# Altium project MFC.PrjPcb
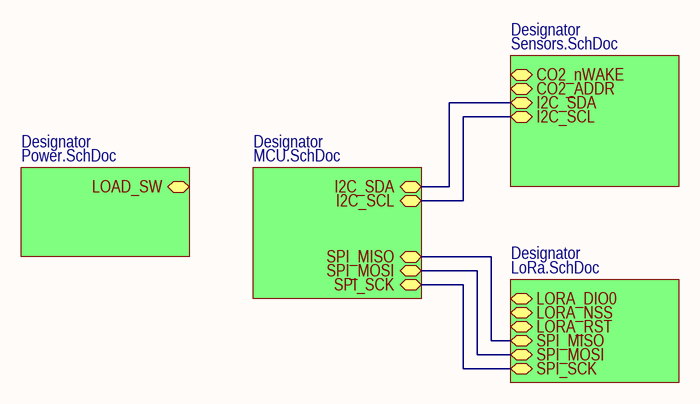
[diagram p0: Main.SchDoc]
6 sheets, 28 parts. Net scope: hierarchical (ports join the sheet entries above them; power ports are global).
Board file: MFC.PcbDoc
Sheets:
  Main.SchDoc
    Designator = Power.SchDoc
    Designator = MCU.SchDoc
    Designator = LoRa.SchDoc
    Designator = Sensors.SchDoc
  Sheet6.SchDoc

## Sheet Main.SchDoc: Наименование
size 209 x 297 mm; ApprovedBy: Утвердил; CheckedBy: Проверил; Author: Разработал; CompanyName: Организация; DrawnBy: Н.Контр; Engineer: Т.Контр; SheetNumber: 1; SheetTotal: 6; PageSetup: Record=PageOptions|CenterHorizontal=True|CenterVertical=True|PrintScale=0.94|XCorrection=1.00|YCorrection=1.00|PrintKind=1|BorderSize=5000000|LeftOffset=0|BottomOffset=0|Orientation=1|PaperLength=1000|PaperWidth=1000|Scale=100|PaperSource=7|PrintQuality=-4|MediaType=1|DitherType=10|PaperKind=A4|PrintScaleMode=1; DecimalNumber: Децимальный номер; HeadOfSector: Нач. сектора; MainDevice: Перв.примен.; Name: Наименование; DocumentName: Sheet1.SCHDOC

### Sub-sheets
Designator = Power.SchDoc: LOAD_SW (bidir)
Designator = MCU.SchDoc: I2C_SDA (bidir), I2C_SCL (bidir), SPI_MISO (bidir), SPI_MOSI (bidir), SPI_SCK (bidir)
Designator = LoRa.SchDoc: LORA_DIO0 (bidir), LORA_NSS (bidir), LORA_RST (bidir), SPI_MISO (bidir), SPI_MOSI (bidir), SPI_SCK (bidir)
Designator = Sensors.SchDoc: CO2_ADDR (bidir), I2C_SDA (bidir), CO2_nWAKE (bidir), I2C_SCL (bidir)

### Nets
I2C_SCL: sheet Designator/I2C_SCL, sheet Designator/I2C_SCL
I2C_SDA: sheet Designator/I2C_SDA, sheet Designator/I2C_SDA
LORA_MISO: sheet Designator/SPI_MISO, sheet Designator/SPI_MISO
LORA_MOSI: sheet Designator/SPI_MOSI, sheet Designator/SPI_MOSI
LORA_SCK: sheet Designator/SPI_SCK, sheet Designator/SPI_SCK

### Notes on the sheet
- Перв.примен.
- Справ.№
- Подп. и дата
- Инв.№ дубл.
- Взам.инв.№
- Подп.и дата
- Разраб.
- Изм.
- Лист
- № докум.
- Подп.
- Дата
- Лит.
- Масштаб
- Масса
- Т.контр.
- Пров.
- ПРИНЦИПИАЛЬНАЯ
- СХЕМА   ЭЛЕКТРИЧЕСКАЯ
- Листов
- Инв.№ подл.
- Утв.
- Н.контр.
- Нач.сект.
- Копировал
- Формат  A3

## Sheet Power.SchDoc: Наименование
size 209 x 297 mm; ApprovedBy: Утвердил; CheckedBy: Проверил; Author: Разработал; CompanyName: Организация; DrawnBy: Н.Контр; Engineer: Т.Контр; SheetNumber: 2; SheetTotal: 6; PageSetup: Record=PageOptions|CenterHorizontal=True|CenterVertical=True|PrintScale=0.94|XCorrection=1.00|YCorrection=1.00|PrintKind=1|BorderSize=5000000|LeftOffset=0|BottomOffset=0|Orientation=1|PaperLength=1000|PaperWidth=1000|Scale=100|PaperSource=7|PrintQuality=-4|MediaType=1|DitherType=10|PaperKind=A4|PrintScaleMode=1; DecimalNumber: Децимальный номер; HeadOfSector: Нач. сектора; MainDevice: Перв.примен.; Name: Наименование; DocumentName: Sheet1.SCHDOC
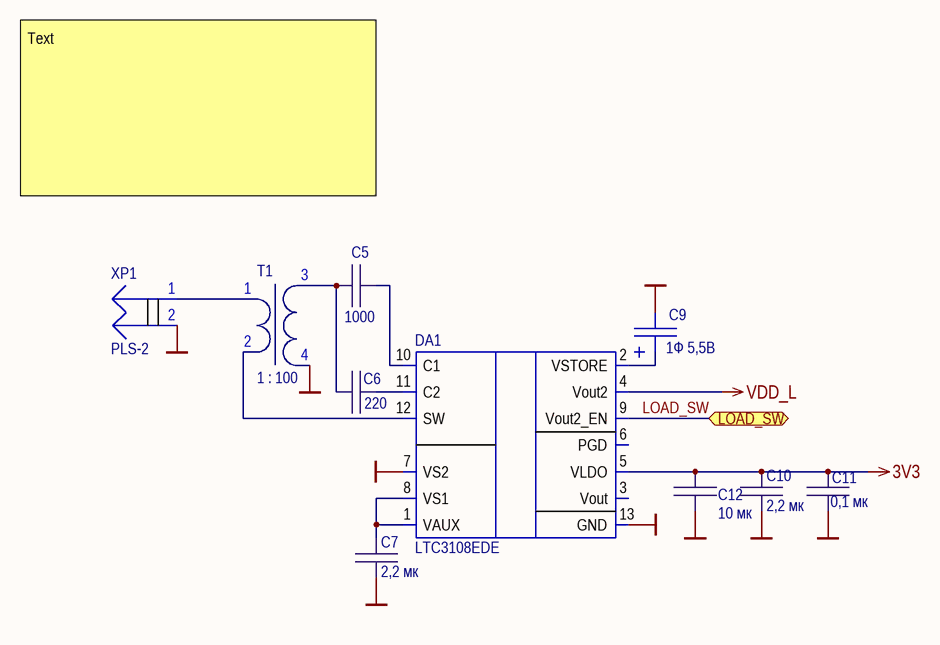
[diagram p1: Power.SchDoc]

### Parts
C5  1000  [C_0603]
C6  220  [C_0603]
C7  2,2 мк  [C_0603]
C9  1Ф 5,5В  [EECF5R5u]
C10  2,2 мк  [C_0603]
C11  0,1 мк  [C_0603]
C12  10 мк  [C_0603]
DA1  LTC3108EDE  [DFN-12]
T1  1 : 100  [LPR6235]
XP1  PLS-2  [PLS-2]

### Ports
LOAD_SW (bidir)

### Nets
3V3: C10.2 C11.2 C12.2 DA1.5(VLDO)
GND: C7.1 C9.2 C10.1 C11.1 C12.1 DA1.7(VS2) DA1.13(GND) T1.4 XP1.2
VDD_L: DA1.4(Vout2)
LOAD_SW: DA1.9(Vout2_EN) ; port LOAD_SW
NetC5_1: C5.1 C6.1 T1.3
NetC5_2: C5.2 DA1.10(C1)
NetC6_2: C6.2 DA1.11(C2)
NetC7_2: C7.2 DA1.1(VAUX) DA1.8(VS1)
NetC9_1: C9.1 DA1.2(VSTORE)
NetDA1_12: DA1.12(SW) T1.2
NetT1_1: T1.1 XP1.1

Not connected (* = marked no-connect by the designer): DA1 3(Vout) 6(PGD)

### Notes on the sheet
- Text
- Подп. и дата
- Инв.№ дубл.
- Взам.инв.№
- Подп.и дата
- Инв.№ подл.
- Изм.
- Лист
- № докум.
- Подп.
- Дата
- Формат  A4

### Library data of the parts
C5 = GRM1885C1H102FA01J: CAP CER 1000PF 50V C0G/NP0 0603; Manufacturer: Murata Electronics; Part Number: GRM1885C1H102FA01J; Value: 1000pF; ComponentLink1URL: https://www.murata.com/~/media/webrenewal/support/library/catalog/products/capacitor/mlcc/c02e.ashx?la=en-us; ComponentLink1Description: Datasheet; Component Type: Capasitor
C6 = GRM1885C2A221FA01D: CAP CER 220PF 100V C0G/NP0 0603; Manufacturer: Murata Electronics; Part Number: GRM1885C2A221FA01D; Value: 220pF; ComponentLink1URL: https://www.murata.com/~/media/webrenewal/support/library/catalog/products/capacitor/mlcc/c02e.ashx?la=en-us; ComponentLink1Description: Datasheet; Component Type: Capasitor
C7 C10 = GRM188R61E225MA12D: CAP CER 2.2UF 25V X5R 0603; Manufacturer: Murata Electronics; Value: 2.2µF; Part Number: GRM188R61E225MA12D; ComponentLink1URL: https://search.murata.co.jp/Ceramy/image/img/A01X/G101/ENG/GRM188R61E225MA12-01.pdf; ComponentLink1Description: Datasheet; Component Type: Capasitor
C9 = EECF5R5U105: 1 Ф, 5.5 В, 5 мм, 2208H, Ионистор
C11 = GRM188R72A104MA35D: CAP CER 0.1UF 100V X7R 0603; Manufacturer: Murata Electronics; Value: 0.1µF; Part Number: GRM188R72A104MA35D; ComponentLink1URL: https://search.murata.co.jp/Ceramy/image/img/A01X/G101/ENG/GRM188R72A104MA35-01.pdf; ComponentLink1Description: Datasheet; Component Type: Capasitor
C12 = GRM185R60J106ME15J: CAP CER 10UF 6.3V X5R 0603; Manufacturer: Murata Electronics; Value: 10µF; Part Number: GRM185R60J106ME15J; ComponentLink1URL: https://search.murata.co.jp/Ceramy/image/img/A01X/G101/ENG/GRM185R60J106ME15-01.pdf; ComponentLink1Description: Datasheet; Component Type: Capasitor
DA1 = LTC3108EDE: Ultralow Voltage Step-Up Converter and Power Manager
T1 = LPR6235-752SMR: Coupled Inductor

## Sheet MCU.SchDoc: Наименование
size 209 x 297 mm; ApprovedBy: Утвердил; CheckedBy: Проверил; Author: Разработал; CompanyName: Организация; DrawnBy: Н.Контр; Engineer: Т.Контр; SheetNumber: 3; SheetTotal: 6; PageSetup: Record=PageOptions|CenterHorizontal=True|CenterVertical=True|PrintScale=0.94|XCorrection=1.00|YCorrection=1.00|PrintKind=1|BorderSize=5000000|LeftOffset=0|BottomOffset=0|Orientation=1|PaperLength=1000|PaperWidth=1000|Scale=100|PaperSource=7|PrintQuality=-4|MediaType=1|DitherType=10|PaperKind=A4|PrintScaleMode=1; DecimalNumber: Децимальный номер; HeadOfSector: Нач. сектора; MainDevice: Перв.примен.; Name: Наименование; DocumentName: Sheet1.SCHDOC
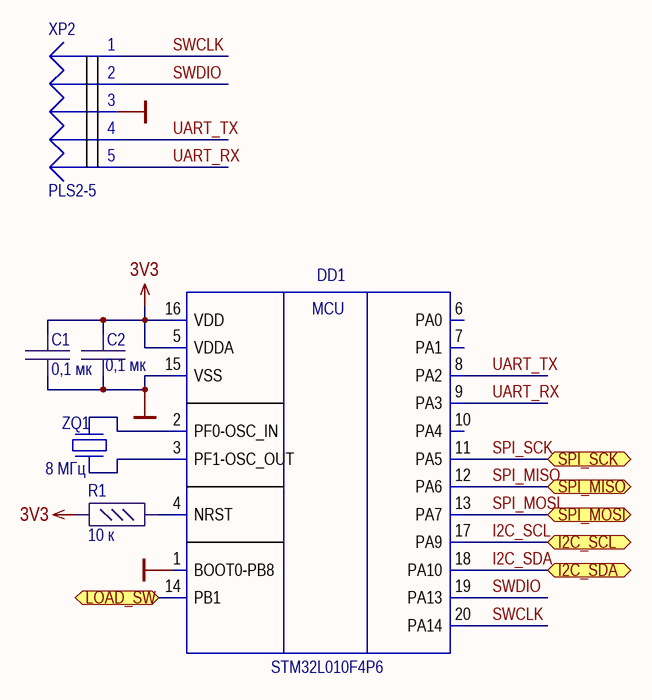
[diagram p2: MCU.SchDoc]

### Parts
C1  0,1 мк  [C_0603]
C2  0,1 мк  [C_0603]
DD1  STM32L010F4P6  [TSSOP-20]
R1  10 к  [R_0603]
XP2  PLS2-5  [PLS2-5]
ZQ1  8 МГц  [MJ CRYSTAL]

### Ports
I2C_SCL (bidir), I2C_SDA (bidir), LOAD_SW (bidir), SPI_MISO (bidir), SPI_MOSI (bidir), SPI_SCK (bidir)

### Nets
3V3: C1.2 C2.2 DD1.5(VDDA) DD1.16(VDD) R1.1
GND: C1.1 C2.1 DD1.1(BOOT0-PB8) DD1.15(VSS) XP2.3
I2C_SCL: DD1.17(PA9) ; port I2C_SCL
I2C_SDA: DD1.18(PA10) ; port I2C_SDA
SPI_MISO: DD1.12(PA6) ; port SPI_MISO  [project net LORA_MISO]
SPI_MOSI: DD1.13(PA7) ; port SPI_MOSI  [project net LORA_MOSI]
SPI_SCK: DD1.11(PA5) ; port SPI_SCK  [project net LORA_SCK]
SWCLK: DD1.20(PA14) XP2.1
SWDIO: DD1.19(PA13) XP2.2
UART_RX: DD1.9(PA3) XP2.5
UART_TX: DD1.8(PA2) XP2.4
NetDD1_2: DD1.2(PF0-OSC_IN) ZQ1.3
NetDD1_3: DD1.3(PF1-OSC_OUT) ZQ1.1
NetDD1_4: DD1.4(NRST) R1.2
NetDD1_14: DD1.14(PB1) ; port LOAD_SW

Not connected (* = marked no-connect by the designer): DD1 6(PA0) 7(PA1) 10(PA4)

### Notes on the sheet
- Подп. и дата
- Инв.№ дубл.
- Взам.инв.№
- Подп.и дата
- Инв.№ подл.
- Изм.
- Лист
- № докум.
- Подп.
- Дата
- Формат  A4
- (in symbol STM32L010F4P6) MCU

### Library data of the parts
C1 C2 = GRM188R72A104MA35D: as C11 on sheet Power; Part Number: GRM188R72A104MA35D; ComponentLink1URL: https://search.murata.co.jp/Ceramy/image/img/A01X/G101/ENG/GRM188R72A104MA35-01.pdf; ComponentLink1Description: Datasheet; Component Type: Capasitor
R1 = CR0603-FX-1002ELF: RES SMD 10K OHM 1% 1/10W 0603; Manufacturer: Bourns Inc.; Part Number: CR0603-FX-1002ELF; Value: 10 к; ComponentLink1URL: https://www.bourns.com/pdfs/chpreztr.pdf; ComponentLink1Description: Datasheet; Component Type: Resistor
ZQ1 = NX5032GA-8MHz

## Sheet LoRa.SchDoc: Наименование
size 209 x 297 mm; ApprovedBy: Утвердил; CheckedBy: Проверил; Author: Разработал; CompanyName: Организация; DrawnBy: Н.Контр; Engineer: Т.Контр; SheetNumber: 4; SheetTotal: 6; PageSetup: Record=PageOptions|CenterHorizontal=True|CenterVertical=True|PrintScale=0.94|XCorrection=1.00|YCorrection=1.00|PrintKind=1|BorderSize=5000000|LeftOffset=0|BottomOffset=0|Orientation=1|PaperLength=1000|PaperWidth=1000|Scale=100|PaperSource=7|PrintQuality=-4|MediaType=1|DitherType=10|PaperKind=A4|PrintScaleMode=1; DecimalNumber: Децимальный номер; HeadOfSector: Нач. сектора; MainDevice: Перв.примен.; Name: Наименование; DocumentName: Sheet1.SCHDOC
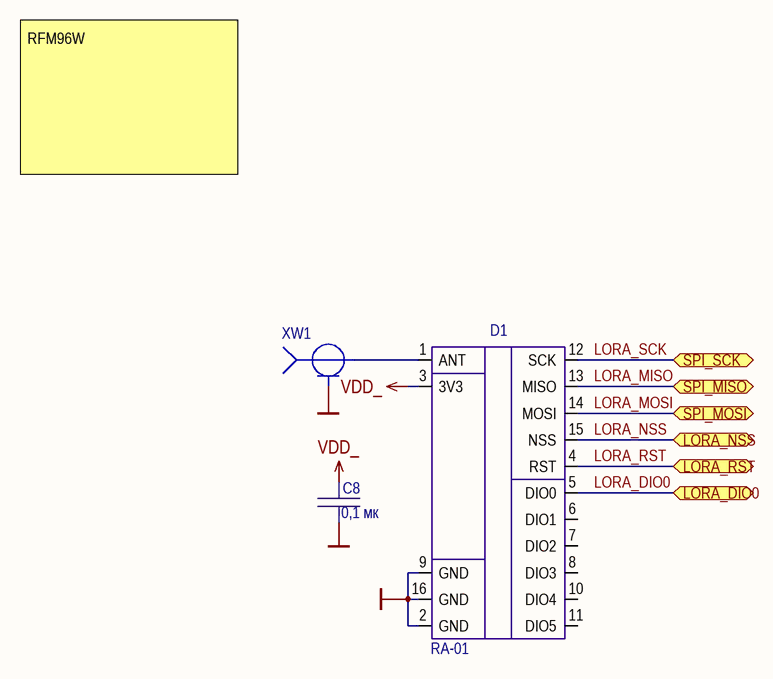
[diagram p3: LoRa.SchDoc]

### Parts
C8  0,1 мк  [C_0603]
D1  RA-01  [RA-02]
XW1  HYR-1139-RP  [SMA (HYR1139)]  (value not drawn)

### Ports
LORA_DIO0 (bidir), LORA_NSS (bidir), LORA_RST (bidir), SPI_MISO (bidir), SPI_MOSI (bidir), SPI_SCK (bidir)

### Nets
GND: D1.2(GND) D1.9(GND) D1.16(GND) XW1.1
VDD_: C8.2 D1.3(3V3)
LORA_DIO0: D1.5(DIO0) ; port LORA_DIO0
LORA_MISO: D1.13(MISO) ; port SPI_MISO
LORA_MOSI: D1.14(MOSI) ; port SPI_MOSI
LORA_NSS: D1.15(NSS) ; port LORA_NSS
LORA_RST: D1.4(RST) ; port LORA_RST
LORA_SCK: D1.12(SCK) ; port SPI_SCK
NetD1_1: D1.1(ANT) XW1.2

Not connected (* = marked no-connect by the designer): C8 1; D1 6(DIO1) 7(DIO2) 8(DIO3) 10(DIO4) 11(DIO5)

### Notes on the sheet
- RFM96W
- Labels drawn without touching a wire or pin: GND
- Подп. и дата
- Инв.№ дубл.
- Взам.инв.№
- Подп.и дата
- Инв.№ подл.
- Изм.
- Лист
- № докум.
- Подп.
- Дата
- Формат  A4

### Library data of the parts
C8 = GRM188R72A104MA35D: as C11 on sheet Power; Part Number: GRM188R72A104MA35D; ComponentLink1URL: https://search.murata.co.jp/Ceramy/image/img/A01X/G101/ENG/GRM188R72A104MA35-01.pdf; ComponentLink1Description: Datasheet; Component Type: Capasitor
D1 = RA-01: LoRa modem

## Sheet Sensors.SchDoc: Наименование
size 209 x 297 mm; ApprovedBy: Утвердил; CheckedBy: Проверил; Author: Разработал; CompanyName: Организация; DrawnBy: Н.Контр; Engineer: Т.Контр; SheetNumber: 5; SheetTotal: 5; PageSetup: Record=PageOptions|CenterHorizontal=True|CenterVertical=True|PrintScale=0.94|XCorrection=1.00|YCorrection=1.00|PrintKind=1|BorderSize=5000000|LeftOffset=0|BottomOffset=0|Orientation=1|PaperLength=1000|PaperWidth=1000|Scale=100|PaperSource=7|PrintQuality=-4|MediaType=1|DitherType=10|PaperKind=A4|PrintScaleMode=1; DecimalNumber: Децимальный номер; HeadOfSector: Нач. сектора; MainDevice: Перв.примен.; Name: Наименование; DocumentName: Sheet1.SCHDOC
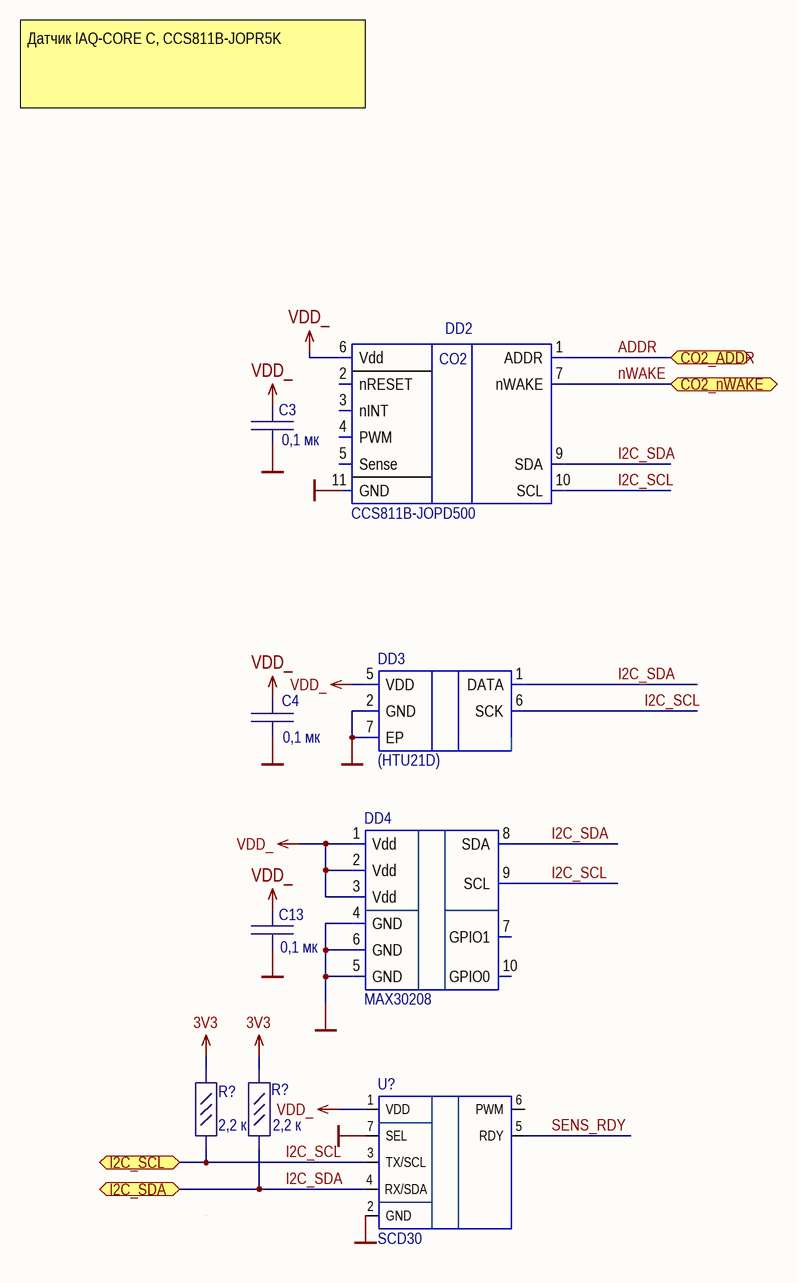
[diagram p4: Sensors.SchDoc]

### Parts
C3  0,1 мк  [C_0603]
C4  0,1 мк  [C_0603]
C13  0,1 мк  [C_0603]
DD2  CCS811B-JOPD500  [DFN-10 (LGA)]
DD3  (HTU21D)  [DFN-6]
DD4  MAX30208  [MAX30208CLB]
R2  2,2 к  [R_0603]
R3  2,2 к  [R_0603]
U?  SCD30  [MODULE_SCD30]

### Ports
CO2_ADDR (bidir), CO2_nWAKE (bidir), I2C_SCL (bidir), I2C_SDA (bidir)

### Nets
3V3: R2.2 R3.2
GND: C3.1 C4.1 C13.1 DD3.2(GND) DD3.7(EP) DD4.4(GND) DD4.5(GND) DD4.6(GND) U?.2(GND) U?.7(SEL)
VDD_: C3.2 C4.2 C13.2 DD2.6(Vdd) DD3.5(VDD) DD4.1(Vdd) DD4.2(Vdd) DD4.3(Vdd) U?.1(VDD)
ADDR: DD2.1(ADDR) ; port CO2_ADDR
I2C_SCL: DD2.10(SCL) DD3.6(SCK) DD4.9(SCL) R3.1 U?.3(TX/SCL) ; port I2C_SCL
I2C_SDA: DD2.9(SDA) DD3.1(DATA) DD4.8(SDA) R2.1 U?.4(RX/SDA) ; port I2C_SDA
nWAKE: DD2.7(nWAKE) ; port CO2_nWAKE
SENS_RDY: U?.5(RDY)

Not connected (* = marked no-connect by the designer): DD2 2(nRESET) 3(nINT) 4(PWM) 5(Sense) 11(GND); DD4 7(GPIO1) 10(GPIO0); U? 6(PWM)

### Notes on the sheet
- Датчик IAQ-CORE C, CCS811B-JOPR5K
- Labels drawn without touching a wire or pin: GND
- Подп. и дата
- Инв.№ дубл.
- Взам.инв.№
- Подп.и дата
- Инв.№ подл.
- Изм.
- Лист
- № докум.
- Подп.
- Дата
- Формат  A4
- (in symbol CCS811B-JOPD500) CO2

### Library data of the parts
C3 C4 C13 = GRM188R72A104MA35D: as C11 on sheet Power; Part Number: GRM188R72A104MA35D; ComponentLink1URL: https://search.murata.co.jp/Ceramy/image/img/A01X/G101/ENG/GRM188R72A104MA35-01.pdf; ComponentLink1Description: Datasheet; Component Type: Capasitor
DD2 = CCS811B-JOPD500: Ultra-Low Power Digital Gas Sensor for / Monitoring Indoor Air Quality
DD3 = HPP845E031R5: Digital Relative Humidity sensor with / Temperature output
DD4 = MAX30208: ±0.1°C Accurate, I2C Digital Temperature Sensor
R2 R3 = CR0603-FX-2201ELF: RES SMD 2.2K OHM 1% 1/10W 0603; Manufacturer: Bourns Inc.; Part Number: CR0603-FX-2201ELF; Value: 2,2 к; ComponentLink1URL: https://www.bourns.com/pdfs/chpreztr.pdf; ComponentLink1Description: Datasheet; Component Type: Resistor
U? = SCD30: Carbon Dioxide _CO2_ Sensor I²C, Modbus, PWM; MF: Sensirion AG; Package: None; MP: SCD30; Value: *; Availability: Unavailable; SnapEDA_Link: https://www.snapeda.com/parts/SCD30/Sensirion%20AG/view-part/2779194/?ref=snap; Price: None

## Sheet Sheet6.SchDoc: Наименование
size 420 x 297 mm; ApprovedBy: Утвердил; CheckedBy: Проверил; Author: Разработал; CompanyName: Организация; DrawnBy: Н.Контр; Engineer: Т.Контр; SheetNumber: 6; SheetTotal: 6; PageSetup: Record=PageOptions|CenterHorizontal=True|CenterVertical=True|PrintScale=0.94|XCorrection=1.00|YCorrection=1.00|PrintKind=1|BorderSize=5000000|LeftOffset=0|BottomOffset=0|Orientation=1|PaperLength=1000|PaperWidth=1000|Scale=100|PaperSource=7|PrintQuality=-4|MediaType=1|DitherType=10|PaperKind=A4|PrintScaleMode=1; DecimalNumber: Децимальный номер; HeadOfSector: Нач. сектора; MainDevice: Перв.примен.; Name: Наименование; DocumentName: Sheet1.SCHDOC

### Notes on the sheet
- Подп. и дата
- Инв.№ дубл.
- Взам.инв.№
- Подп.и дата
- Инв.№ подл.
- Изм.
- Лист
- № докум.
- Подп.
- Дата
- Формат  A3

## Nets that join several sheets
3V3: Power (C10.2 C11.2 C12.2 DA1.5), MCU (5 pins), Sensors (R2.2 R3.2)
GND: Power (9 pins), MCU (5 pins), LoRa (D1.2 D1.9 D1.16 XW1.1), Sensors (10 pins)
VDD_: LoRa (C8.2 D1.3), Sensors (9 pins)
I2C_SCL: MCU (DD1.17), Sensors (5 pins)
I2C_SDA: MCU (DD1.18), Sensors (5 pins)
LORA_MISO: MCU (DD1.12), LoRa (D1.13)
LORA_MOSI: MCU (DD1.13), LoRa (D1.14)
LORA_SCK: MCU (DD1.11), LoRa (D1.12)